# Altium schematic sheet MOSFET_IRF540.SchDoc: High Power MOSFET
size A4; Author: Nikola Rašević; Organization: Memristor Robotics
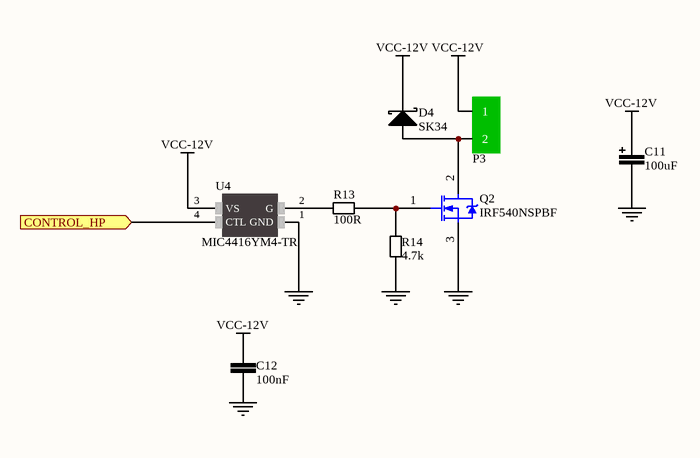
[diagram p0: MOSFET_IRF540.SchDoc]

## Parts
C11  100uF  [CAP5X11_RADIAL]
C12  100nF  [CER_0805]
D4  SK34  [DO214AC]
P3  DRV_B3  [MOTOR_CON]  (value not drawn)
Q2  IRF540NSPBF  [D2PAK-2]
R13  100R  [RESC2013X38N-0805-NOOVERLAY]
R14  4.7k  [RESC2013X38N-0805-NOOVERLAY]
U4  MIC4416YM4-TR  [SOT143-4]

## Ports
CONTROL_HP (in)

## Nets
GND: C11.2 C12.1 Q2.3(S) R14.1 U4.1(GND)
VCC-12V: C11.1 C12.2 D4.1(Cathode) P3.1 U4.3(VS)
CONTROL_HP: U4.4(CTL) ; port CONTROL_HP
NetD4_2: D4.2(Anode) P3.2 Q2.2(D)
NetQ2_1: Q2.1(G) R13.2 R14.2
NetR13_1: R13.1 U4.2(G)

## Notes on the sheet
- Title
- Date:
- Design Engineer:
- Time:
- Revision:
- Sheet
- of
- Size:
- A4
- www.memristor-robotics.io
- File:

## Library data of the parts
C11 = 00004704: CAP ALU 4.7u 25V 20%; Capacitance: 100uF
C12 = 00002105: CAP CER 100n 50V X7R 10% 0805; Capacitance: 100nF
D4 = SK34: DIODE SCHOTTKY 40V 3A DO214AC; Manufacturer: Vishay Semiconductor Diodes Division; Barcode: 0100000007488; id: 62; Assembly: SMD; Speed: Fast Recovery =< 500ns, > 200mA (Io); Voltage  Forward: 550mV @ 3A; item_id: 1025; Recommended Rating: Silver; Manufacturer Part Number: SK34; Category: Discrete Semiconductor Products; Datasheet URL: http://www.vishay.com/docs/88896/b330la.pdf; Package Case: DO-214AC, SMA; Family: DIODE; Voltage  DC Reverse: 40V; Current  Average Rectified: 3A; Diode Type: Schottky; Part Type: Discrete Semiconductors
P3 = MOT_CONN: CONNECTOR FOR MOTOR OUTPUT; Manufacturer Part Number: *
Q2 = IRF540N: N-MOS; Manufacturer: INTERNATIONAL RECTIFIER; Manufacturer Part Number: IRF540NSPBF; Order Code: IRF540NS; Package: TO-263 SMD; Price: DIN 62.54; Supplier: Comet.rs
R13 = 00001000: RES SMD 100 Ohm 1/8W 0805; Power: 0.125W, 1/8W; Resistance: 100R; Assembly: SMD; Barcode: 00001000
R14 = 00004701: RES SMD 4.7 kOhm 1/8W 0805; Power: 0.125W, 1/8W; Resistance: 4.7k; Assembly: SMD; Barcode: 00004701
U4 = MIC4416: IC DRIVER MOSF LOW SIDE SOT143-4; Assembly: SMD; Manufacturer Part Number: MIC4416YM4-TR; Datasheet Link: http://ww1.microchip.com/downloads/en/DeviceDoc/mic4416.pdf; Category: Integrated Circuits (ICs); Package: SOT-143; Family: MOSFET Driver; Product Page Farnell: http://uk.farnell.com/microchip/mic4416ym4-tr/driver-mosfet-low-side-smd-4416/dp/2510112